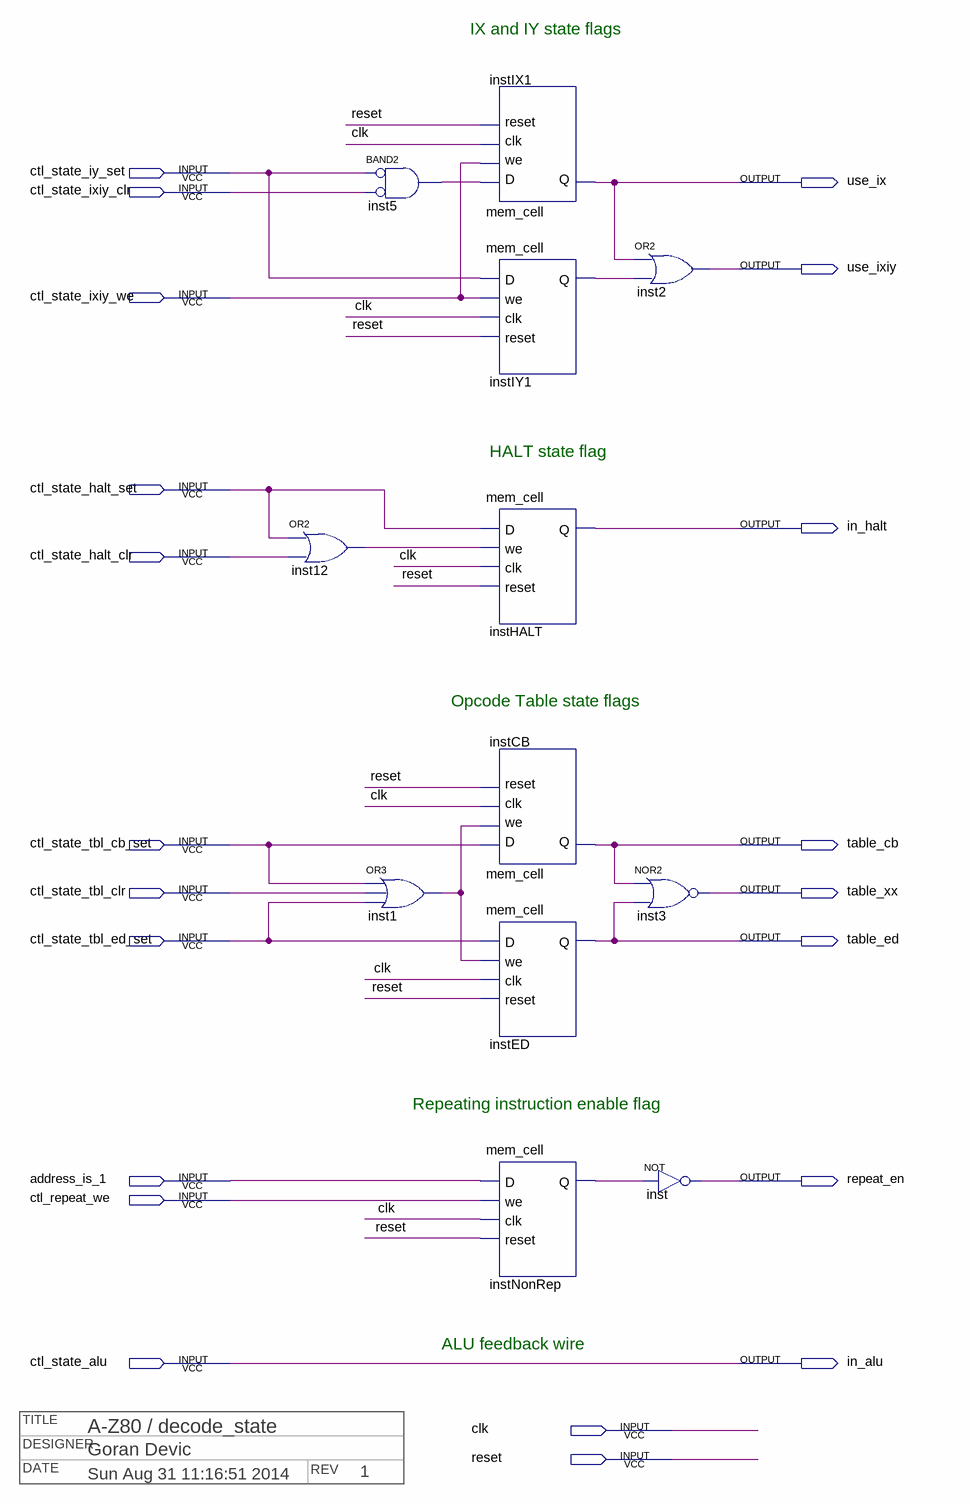
[diagram p0: schematic sheet]
// Quartus schematic decode_state.bdf as structural Verilog: 12 symbols, 21 pins
// Title block: TITLE: A-Z80 / decode_state; DESIGNER: Goran Devic; DATE: Sun Aug 31 11:16:51 2014; REV: 1
module decode_state (
  input  ctl_state_iy_set,
  input  ctl_state_ixiy_clr,
  input  ctl_state_ixiy_we,
  input  ctl_state_halt_set,
  input  ctl_state_halt_clr,
  input  ctl_state_tbl_cb_set,
  input  ctl_state_tbl_clr,
  input  ctl_state_tbl_ed_set,
  input  address_is_1,
  input  ctl_repeat_we,
  input  ctl_state_alu,
  input  clk,
  input  reset,
  output use_ix,
  output use_ixiy,
  output in_halt,
  output table_cb,
  output table_xx,
  output table_ed,
  output repeat_en,
  output in_alu
);

  wire inst1_out, inst5_out, inst12_out, instIY1_q, instNonRep_q;

  or inst12 (inst12_out, ctl_state_halt_set, ctl_state_halt_clr);
  and inst5 (inst5_out, ~ctl_state_iy_set, ~ctl_state_ixiy_clr);  // BAND2
  or inst1 (inst1_out, ctl_state_tbl_cb_set, ctl_state_tbl_clr, ctl_state_tbl_ed_set);
  mem_cell instIX1 (.D(inst5_out), .we(ctl_state_ixiy_we), .clk(clk), .reset(reset), .Q(use_ix));
  mem_cell instIY1 (.D(ctl_state_iy_set), .we(ctl_state_ixiy_we), .clk(clk), .reset(reset), .Q(instIY1_q));
  mem_cell instHALT (.D(ctl_state_halt_set), .we(inst12_out), .clk(clk), .reset(reset), .Q(in_halt));
  mem_cell instCB (.D(ctl_state_tbl_cb_set), .we(inst1_out), .clk(clk), .reset(reset), .Q(table_cb));
  mem_cell instED (.D(ctl_state_tbl_ed_set), .we(inst1_out), .clk(clk), .reset(reset), .Q(table_ed));
  mem_cell instNonRep (.D(address_is_1), .we(ctl_repeat_we), .clk(clk), .reset(reset), .Q(instNonRep_q));
  or inst2 (use_ixiy, use_ix, instIY1_q);
  nor inst3 (table_xx, table_cb, table_ed);
  not inst (repeat_en, instNonRep_q);

  assign in_alu = ctl_state_alu;

  // Notes on the sheet:
  //   IX and IY state flags
  //   HALT state flag
  //   Opcode Table state flags
  //   Repeating instruction enable flag
  //   ALU feedback wire
endmodule
